# EAGLE design Layout_Controller_Florian (EAGLE 5.07)
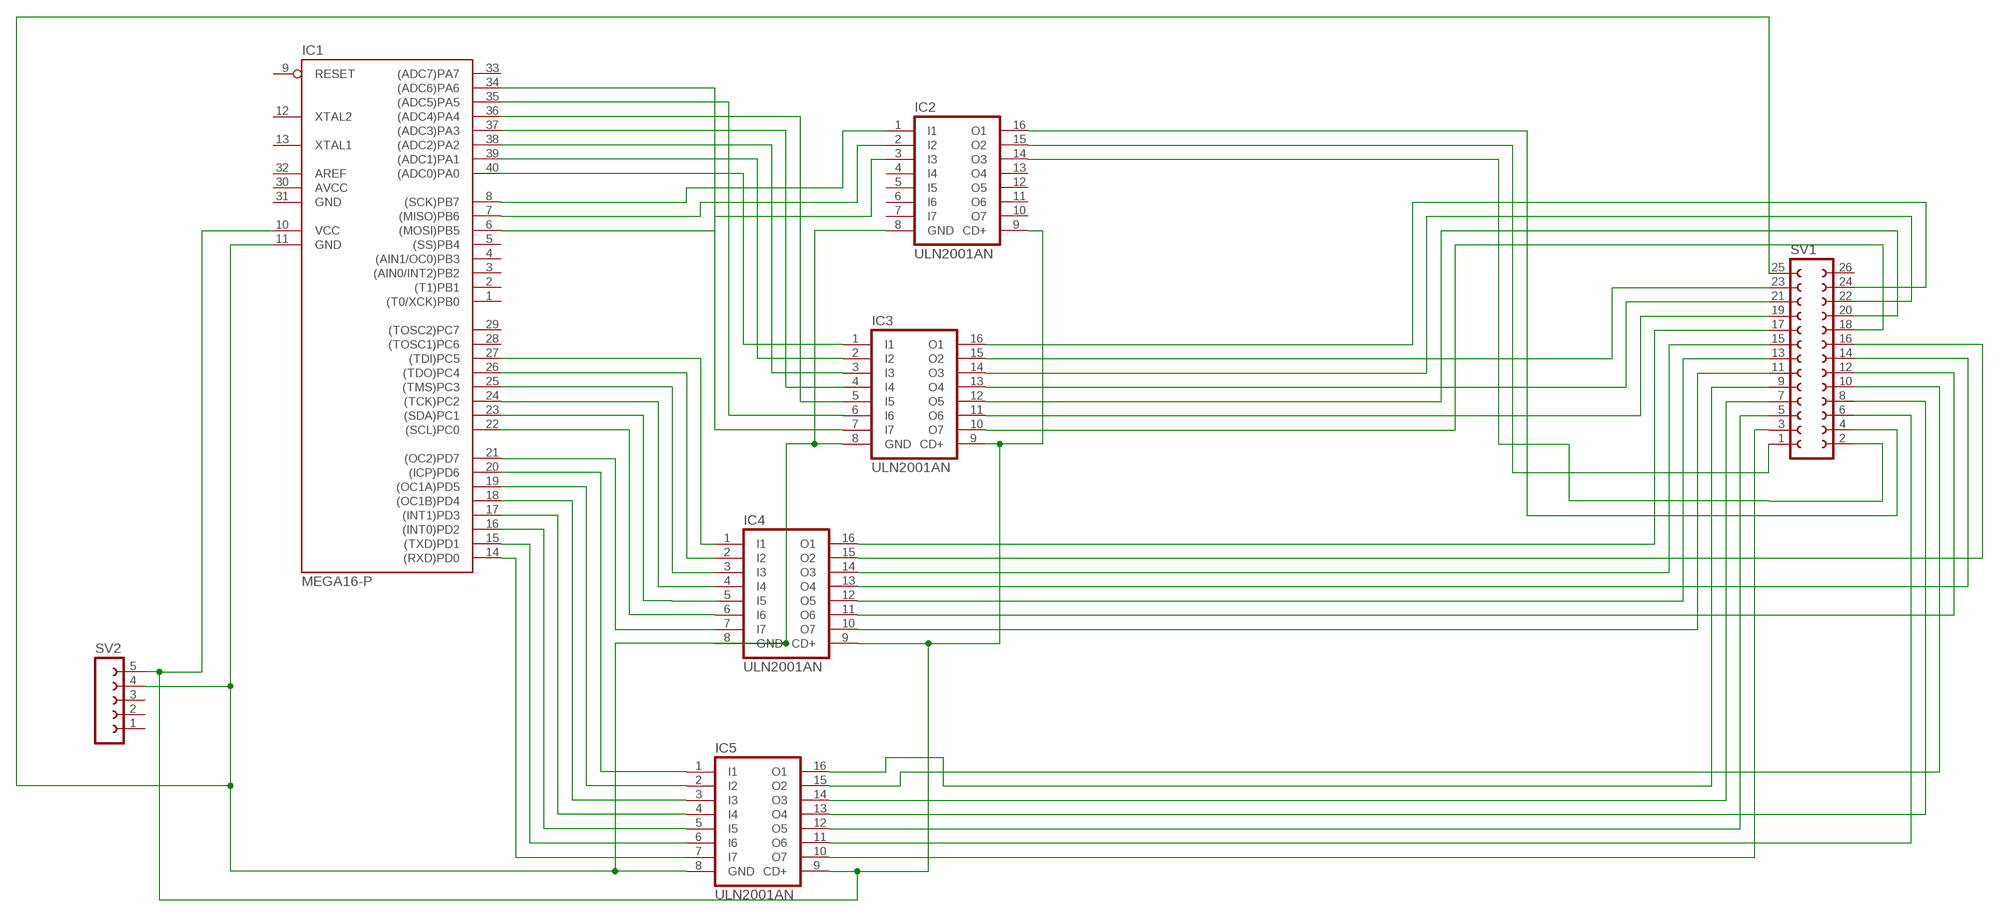
[diagram p0: schematic, sheet 1]

## Parts
IC1  MEGA16-P  [DIL40]
IC2  ULN2001AN  [DIL16]
IC3  ULN2001AN  [DIL16]
IC4  ULN2001AN  [DIL16]
IC5  ULN2001AN  [DIL16]
SV1  FE13-2W  [FE13-2W]
SV2  FE05-1  [FE05-1]

## Nets
N$1: IC1.6((MOSI)PB5) IC2.3(I3)
N$2: IC1.7((MISO)PB6) IC2.2(I2)
N$3: IC1.8((SCK)PB7) IC2.1(I1)
N$4: IC2.14(O3) SV1.2
N$5: IC2.15(O2) SV1.1
N$6: IC2.16(O1) SV1.4
N$7: IC5.12(O5) SV1.5
N$8: IC5.10(O7) SV1.3
N$9: IC5.11(O6) SV1.6
N$10: IC5.14(O3) SV1.7
N$11: IC5.13(O4) SV1.8
N$12: IC5.16(O1) SV1.9
N$13: IC5.15(O2) SV1.10
N$14: IC4.10(O7) SV1.11
N$15: IC4.11(O6) SV1.12
N$16: IC4.12(O5) SV1.13
N$17: IC4.13(O4) SV1.14
N$18: IC4.14(O3) SV1.15
N$19: IC4.15(O2) SV1.16
N$20: IC4.16(O1) SV1.17
N$21: IC3.10(O7) SV1.18
N$22: IC3.11(O6) SV1.19
N$23: IC3.12(O5) SV1.20
N$24: IC3.13(O4) SV1.21
N$25: IC3.14(O3) SV1.22
N$26: IC3.15(O2) SV1.23
N$27: IC3.16(O1) SV1.24
N$28: IC1.34((ADC6)PA6) IC3.7(I7)
N$49: IC1.14((RXD)PD0) IC5.7(I7)
N$50: IC1.15((TXD)PD1) IC5.6(I6)
N$51: IC1.16((INT0)PD2) IC5.5(I5)
N$52: IC1.17((INT1)PD3) IC5.4(I4)
N$53: IC1.18((OC1B)PD4) IC5.3(I3)
N$54: IC1.19((OC1A)PD5) IC5.2(I2)
N$55: IC1.20((ICP)PD6) IC5.1(I1)
N$56: IC1.27((TDI)PC5) IC4.1(I1)
N$57: IC1.26((TDO)PC4) IC4.2(I2)
N$58: IC1.25((TMS)PC3) IC4.3(I3)
N$59: IC1.24((TCK)PC2) IC4.4(I4)
N$60: IC1.23((SDA)PC1) IC4.5(I5)
N$61: IC1.22((SCL)PC0) IC4.6(I6)
N$62: IC1.21((OC2)PD7) IC4.7(I7)
N$64: IC1.35((ADC5)PA5) IC3.6(I6)
N$65: IC1.40((ADC0)PA0) IC3.1(I1)
N$66: IC1.39((ADC1)PA1) IC3.2(I2)
N$67: IC1.38((ADC2)PA2) IC3.3(I3)
N$68: IC1.37((ADC3)PA3) IC3.4(I4)
N$69: IC1.36((ADC4)PA4) IC3.5(I5)
N$73: IC1.10(VCC) IC2.9(CD+) IC3.9(CD+) IC4.9(CD+) IC5.9(CD+) SV2.5
N$74: IC1.11(GND) IC2.8(GND) IC3.8(GND) IC4.8(GND) IC5.8(GND) SV1.25 SV2.4
Unconnected: IC1.1((T0/XCK)PB0) IC1.2((T1)PB1) IC1.3((AIN0/INT2)PB2) IC1.4((AIN1/OC0)PB3) IC1.5((SS)PB4) IC1.9(RESET) IC1.12(XTAL2) IC1.13(XTAL1) IC1.28((TOSC1)PC6) IC1.29((TOSC2)PC7) IC1.32(AREF) IC1.33((ADC7)PA7) IC2.4(I4) IC2.5(I5) IC2.6(I6) IC2.7(I7) IC2.10(O7) IC2.11(O6) IC2.12(O5) IC2.13(O4) SV1.26 SV2.1 SV2.2 SV2.3

## Power pins joined to a net without a drawn wire
AVCC: IC1.30(AVCC)
GND: IC1.31(GND)

## Library data of the parts
IC1 = atmel:MEGA16-P: MICROCONTROLLER 16 Kbytes FLASH 1 kbytes SRAM 512 bytes EEPROM USART 8-channel 10 bit ADC Source: avr.lbr
IC2-IC5 = uln-udn:ULN2001A: DRIVER ARRAY
SV1 = con-lsta:FE13-2W: FEMALE HEADER
SV2 = con-lsta:FE05-1: FEMALE HEADER

## Board
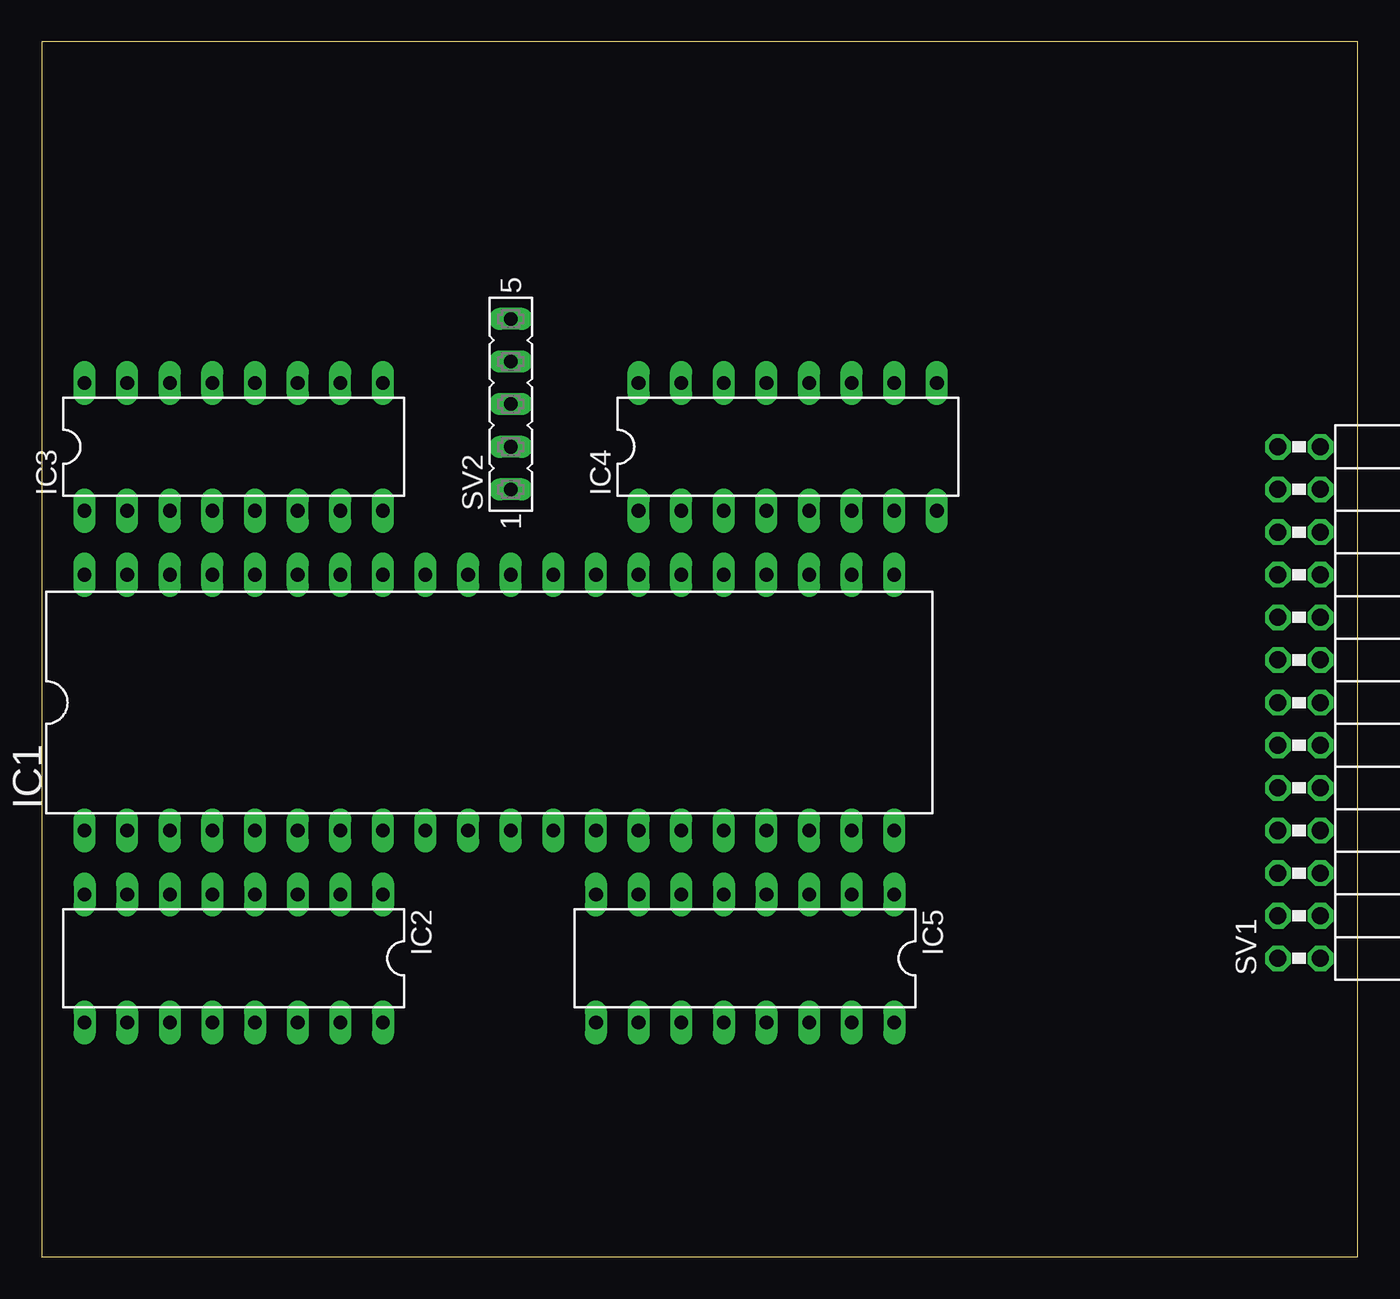
[diagram p1: board, top side]
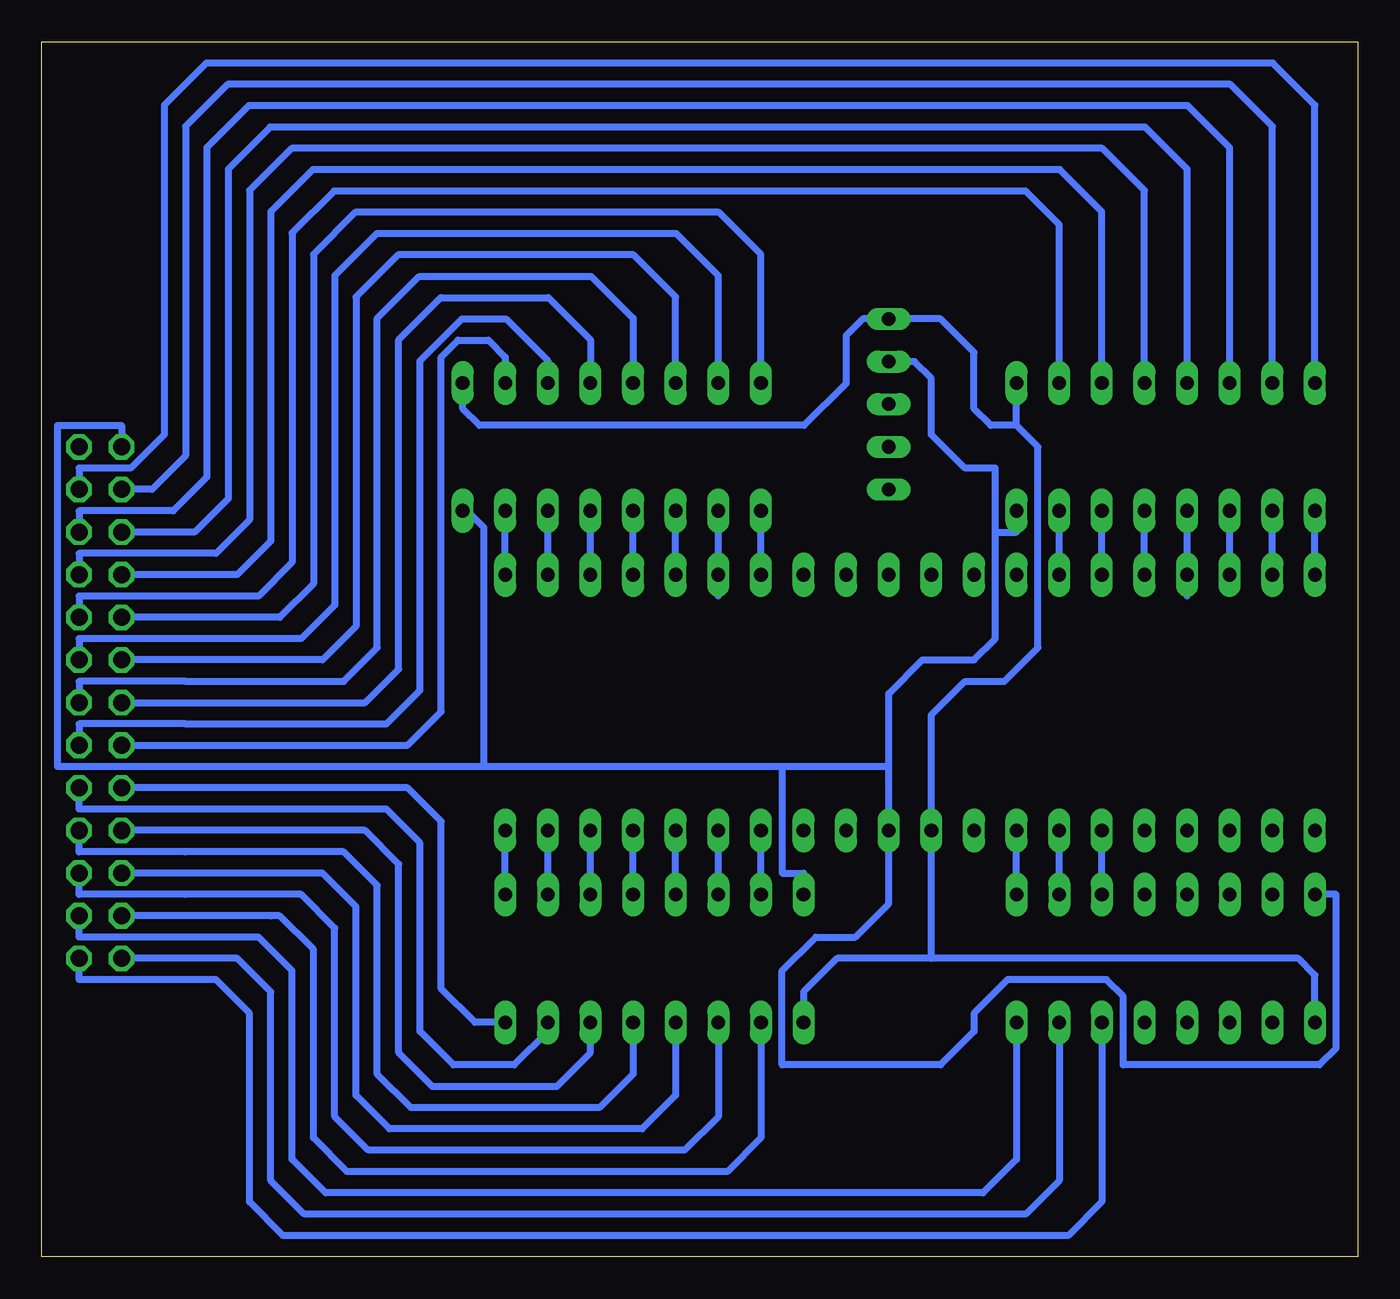
[diagram p2: board, bottom side, seen from below]

Size 78.41 x 72.38 mm. Coordinates in mm from the lower left corner, seen from the top.
Outline: 0,0 78.41,0 78.41,72.38 0,72.38 0,0
Copper layers (1*16): Top 0.035mm / dielectric 1.5mm / Bottom 0.035mm
Design rules "default": minimum track width 10mil, minimum drill 24mil, track to track 8mil, track to pad 8mil, pad to pad 8mil, via to via 8mil, smd to smd 8mil, copper to edge 40mil, drill to drill 8mil, minimum pad ring 10mil, minimum via ring 8mil, stop-mask expansion 4mil, vias tented up to drill 0mil, thermal gap 10mil

### Footprints (pad centres in the part's own frame; a part is rotated, then mirrored left to right if it is on the bottom)
DIL40 = drill 0.813 long: 1 -24.13,-7.62; 2 -21.59,-7.62; 3 -19.05,-7.62; 4 -16.51,-7.62; 5 -13.97,-7.62; 6 -11.43,-7.62; 7 -8.89,-7.62; 8 -6.35,-7.62; 9 -3.81,-7.62; 10 -1.27,-7.62; 11 1.27,-7.62; 12 3.81,-7.62; 13 6.35,-7.62; 14 8.89,-7.62; 15 11.43,-7.62; 16 13.97,-7.62; 17 16.51,-7.62; 18 19.05,-7.62; 19 21.59,-7.62; 20 24.13,-7.62; 21 24.13,7.62; 22 21.59,7.62; 23 19.05,7.62; 24 16.51,7.62; 25 13.97,7.62; 26 11.43,7.62; 27 8.89,7.62; 28 6.35,7.62; 29 3.81,7.62; 30 1.27,7.62; 31 -1.27,7.62; 32 -3.81,7.62; 33 -6.35,7.62; 34 -8.89,7.62; 35 -11.43,7.62; 36 -13.97,7.62; 37 -16.51,7.62; 38 -19.05,7.62; 39 -21.59,7.62; 40 -24.13,7.62
DIL16 = drill 0.813 long: 1 -8.89,-3.81; 2 -6.35,-3.81; 3 -3.81,-3.81; 4 -1.27,-3.81; 5 1.27,-3.81; 6 3.81,-3.81; 7 6.35,-3.81; 8 8.89,-3.81; 9 8.89,3.81; 10 6.35,3.81; 11 3.81,3.81; 12 1.27,3.81; 13 -1.27,3.81; 14 -3.81,3.81; 15 -6.35,3.81; 16 -8.89,3.81
FE13-2W = drill 1.016 octagon: 1 -15.24,1.27; 2 -15.24,-1.27; 3 -12.7,1.27; 4 -12.7,-1.27; 5 -10.16,1.27; 6 -10.16,-1.27; 7 -7.62,1.27; 8 -7.62,-1.27; 9 -5.08,1.27; 10 -5.08,-1.27; 11 -2.54,1.27; 12 -2.54,-1.27; 13 0,1.27; 14 0,-1.27; 15 2.54,1.27; 16 2.54,-1.27; 17 5.08,1.27; 18 5.08,-1.27; 19 7.62,1.27; 20 7.62,-1.27; 21 10.16,1.27; 22 10.16,-1.27; 23 12.7,1.27; 24 12.7,-1.27; 25 15.24,1.27; 26 15.24,-1.27
FE05-1 = drill 0.813 long: 1 -5.08,0; 2 -2.54,0; 3 0,0; 4 2.54,0; 5 5.08,0

### Placement (x,y rotation side)
IC1  26.67,33.02 0 top
IC2  11.43,17.78 180 top
IC3  11.43,48.26 0 top
IC4  44.45,48.26 0 top
IC5  41.91,17.78 180 top
SV1  74.93,33.02 90 top
SV2  27.94,50.8 90 top

### Tracks (layer width: path | path; a pad name or v marks a point on that pad's centre or on a via)
N$1
  Bottom 0.406: IC2.3 IC1.6
N$2
  Bottom 0.406: IC2.2 IC1.7
N$3
  Bottom 0.406: IC2.1 IC1.8
N$4
  Bottom 0.406: IC2.14 15.24,3.27 17.24,1.27 64.04,1.27 66.04,3.27 66.04,14.51 68.04,16.51 69.85,16.51 76.2,16.51 SV1.2
N$5
  Bottom 0.406: IC2.15 17.78,4.54 19.78,2.54 62.77,2.54 64.77,4.54 64.77,15.78 66.77,17.78 SV1.1
N$6
  Bottom 0.406: IC2.16 20.32,5.81 22.32,3.81 61.5,3.81 63.5,5.81 63.5,17.05 65.5,19.05 69.85,19.05 76.2,19.05 SV1.4
N$7
  Bottom 0.406: IC5.12 40.64,9.62 42.64,7.62 57.69,7.62 59.69,9.62 59.69,20.86 61.69,22.86 SV1.5
N$8
  Bottom 0.406: IC5.10 35.56,7.08 37.56,5.08 60.23,5.08 62.23,7.08 62.23,18.32 64.23,20.32 64.77,20.32 SV1.3
N$9
  Bottom 0.406: IC5.11 38.1,8.35 40.1,6.35 58.96,6.35 60.96,8.35 60.96,19.59 62.96,21.59 69.85,21.59 76.2,21.59 SV1.6
N$10
  Bottom 0.406: SV1.7 59.15,25.4 57.15,23.4 57.15,12.16 55.15,10.16 47.72,10.16 45.72,12.16 IC5.14
N$11
  Bottom 0.406: IC5.13 43.18,10.89 45.18,8.89 56.42,8.89 58.42,10.89 58.42,22.13 60.42,24.13 69.85,24.13 76.2,24.13 SV1.8
N$12
  Bottom 0.406: IC5.16 52.61,13.97 54.61,15.97 54.61,25.94 56.61,27.94 SV1.9
N$13
  Bottom 0.406: IC5.15 48.26,13.43 50.26,11.43 53.88,11.43 55.88,13.43 55.88,24.67 57.88,26.67 69.85,26.67 76.2,26.67 SV1.10
N$14
  Bottom 0.406: SV1.11 56.61,30.48 54.61,32.48 54.61,53.61 53.61,54.61 51.8,54.61 50.8,53.61 IC4.10
N$15
  Bottom 0.406: IC4.11 48.26,53.38 50.76,55.88 53.38,55.88 55.88,53.38 55.88,33.75 57.88,31.75 69.85,31.75 76.2,31.75 SV1.12
N$16
  Bottom 0.406: SV1.13 59.15,33.02 57.15,35.02 57.15,54.65 54.65,57.15 48.22,57.15 45.72,54.65 IC4.12
N$17
  Bottom 0.406: IC4.13 43.18,55.92 45.68,58.42 55.92,58.42 58.42,55.92 58.42,36.29 60.42,34.29 69.85,34.29 76.2,34.29 SV1.14
N$18
  Bottom 0.406: SV1.15 61.69,35.56 59.69,37.56 59.69,57.19 57.19,59.69 43.14,59.69 40.64,57.19 IC4.14
N$19
  Bottom 0.406: IC4.15 38.1,58.46 40.6,60.96 58.46,60.96 60.96,58.46 60.96,38.83 62.96,36.83 69.85,36.83 76.2,36.83 SV1.16
N$20
  Bottom 0.406: SV1.17 64.23,38.1 62.23,40.1 62.23,59.73 59.73,62.23 38.06,62.23 35.56,59.73 IC4.16
N$21
  Bottom 0.406: IC3.10 17.78,61.5 19.78,63.5 61,63.5 63.5,61 63.5,41.37 65.5,39.37 69.85,39.37 76.2,39.37 SV1.18
N$22
  Bottom 0.406: SV1.19 66.77,40.64 64.77,42.64 64.77,62.27 62.27,64.77 17.74,64.77 15.24,62.27 IC3.11
N$23
  Bottom 0.406: IC3.12 12.7,63.54 15.2,66.04 63.54,66.04 66.04,63.54 66.04,43.91 68.04,41.91 76.2,41.91 SV1.20
N$24
  Bottom 0.406: SV1.21 69.31,43.18 67.31,45.18 67.31,64.81 64.81,67.31 12.66,67.31 10.16,64.81 IC3.13
N$25
  Bottom 0.406: SV1.22 76.2,44.45 70.58,44.45 68.58,46.45 68.58,66.08 66.08,68.58 10.12,68.58 7.62,66.08 IC3.14
N$26
  Bottom 0.406: SV1.23 71.85,45.72 69.85,47.72 69.85,67.35 67.35,69.85 7.58,69.85 5.08,67.35 IC3.15
N$27
  Bottom 0.406: SV1.24 76.2,46.99 73.12,46.99 71.12,48.99 71.12,68.62 68.62,71.12 5.04,71.12 2.54,68.62 IC3.16
N$28
  Bottom 0.406: IC1.34 IC3.7
N$49
  Bottom 0.406: IC5.7 IC1.14
N$50
  Bottom 0.406: IC5.6 IC1.15
N$51
  Bottom 0.406: IC5.5 IC1.16
N$52
  Bottom 0.406: IC5.4 IC1.17
N$53
  Bottom 0.406: IC5.3 IC1.18
N$54
  Bottom 0.406: IC5.2 IC1.19
N$55
  Bottom 0.406: IC5.1 IC1.20
N$56
  Bottom 0.406: IC1.27 IC4.1
N$57
  Bottom 0.406: IC1.26 IC4.2 | IC1.26 38.1,39.37 IC1.26
N$58
  Bottom 0.406: IC1.25 IC4.3
N$59
  Bottom 0.406: IC1.24 IC4.4
N$60
  Bottom 0.406: IC1.23 IC4.5
N$61
  Bottom 0.406: IC1.22 IC4.6
N$62
  Bottom 0.406: IC1.21 IC4.7
N$64
  Bottom 0.406: IC1.35 IC3.6
N$65
  Bottom 0.406: IC1.40 IC3.1
N$66
  Bottom 0.406: IC1.39 IC3.2
N$67
  Bottom 0.406: IC1.38 IC3.3
N$68
  Bottom 0.406: IC1.37 IC3.4 | IC1.37 10.16,39.37 IC1.37
N$69
  Bottom 0.406: IC1.36 IC3.5
N$73
  Bottom 0.406: 20.32,49.53 19.05,48.26 19.05,36.29 21.05,34.29 23.4,34.29 25.4,32.29 IC1.10 25.4,17.78 | 20.32,49.53 IC3.9 | 25.4,17.78 31.02,17.78 33.02,15.78 IC5.9 | IC2.9 2.54,16.78 3.54,17.78 25.4,17.78 | IC4.9 53.34,50.53 52.34,49.53 32.98,49.53 30.48,52.03 30.48,54.88 29.48,55.88 SV2.5 24.86,55.88 22.86,53.88 22.86,50.53 21.86,49.53 20.32,49.53
N$74
  Bottom 0.406: 52.07,29.21 52.07,43.45 53.07,44.45 IC4.8 | 52.07,29.21 77.47,29.21 77.47,49.53 73.66,49.53 SV1.25 | IC5.8 33.02,22.86 34.29,22.86 34.29,29.21 | 34.29,29.21 52.07,29.21 | IC1.11 27.94,29.21 34.29,29.21 | IC1.11 27.94,33.56 25.94,35.56 22.86,35.56 21.59,36.83 21.59,43.18 | 21.59,43.18 20.32,43.18 IC3.8 | IC1.11 27.94,21.05 29.94,19.05 32.29,19.05 34.29,17.05 34.29,11.43 24.86,11.43 22.86,13.43 22.86,14.51 20.86,16.51 14.97,16.51 13.97,15.51 13.97,11.43 2.27,11.43 1.27,12.43 1.27,21.59 IC2.8 | 21.59,43.18 21.59,46.99 23.4,46.99 25.4,48.99 25.4,52.34 26.4,53.34 SV2.4